# EAGLE design T05_version11_2 (EAGLE 7.1.0)
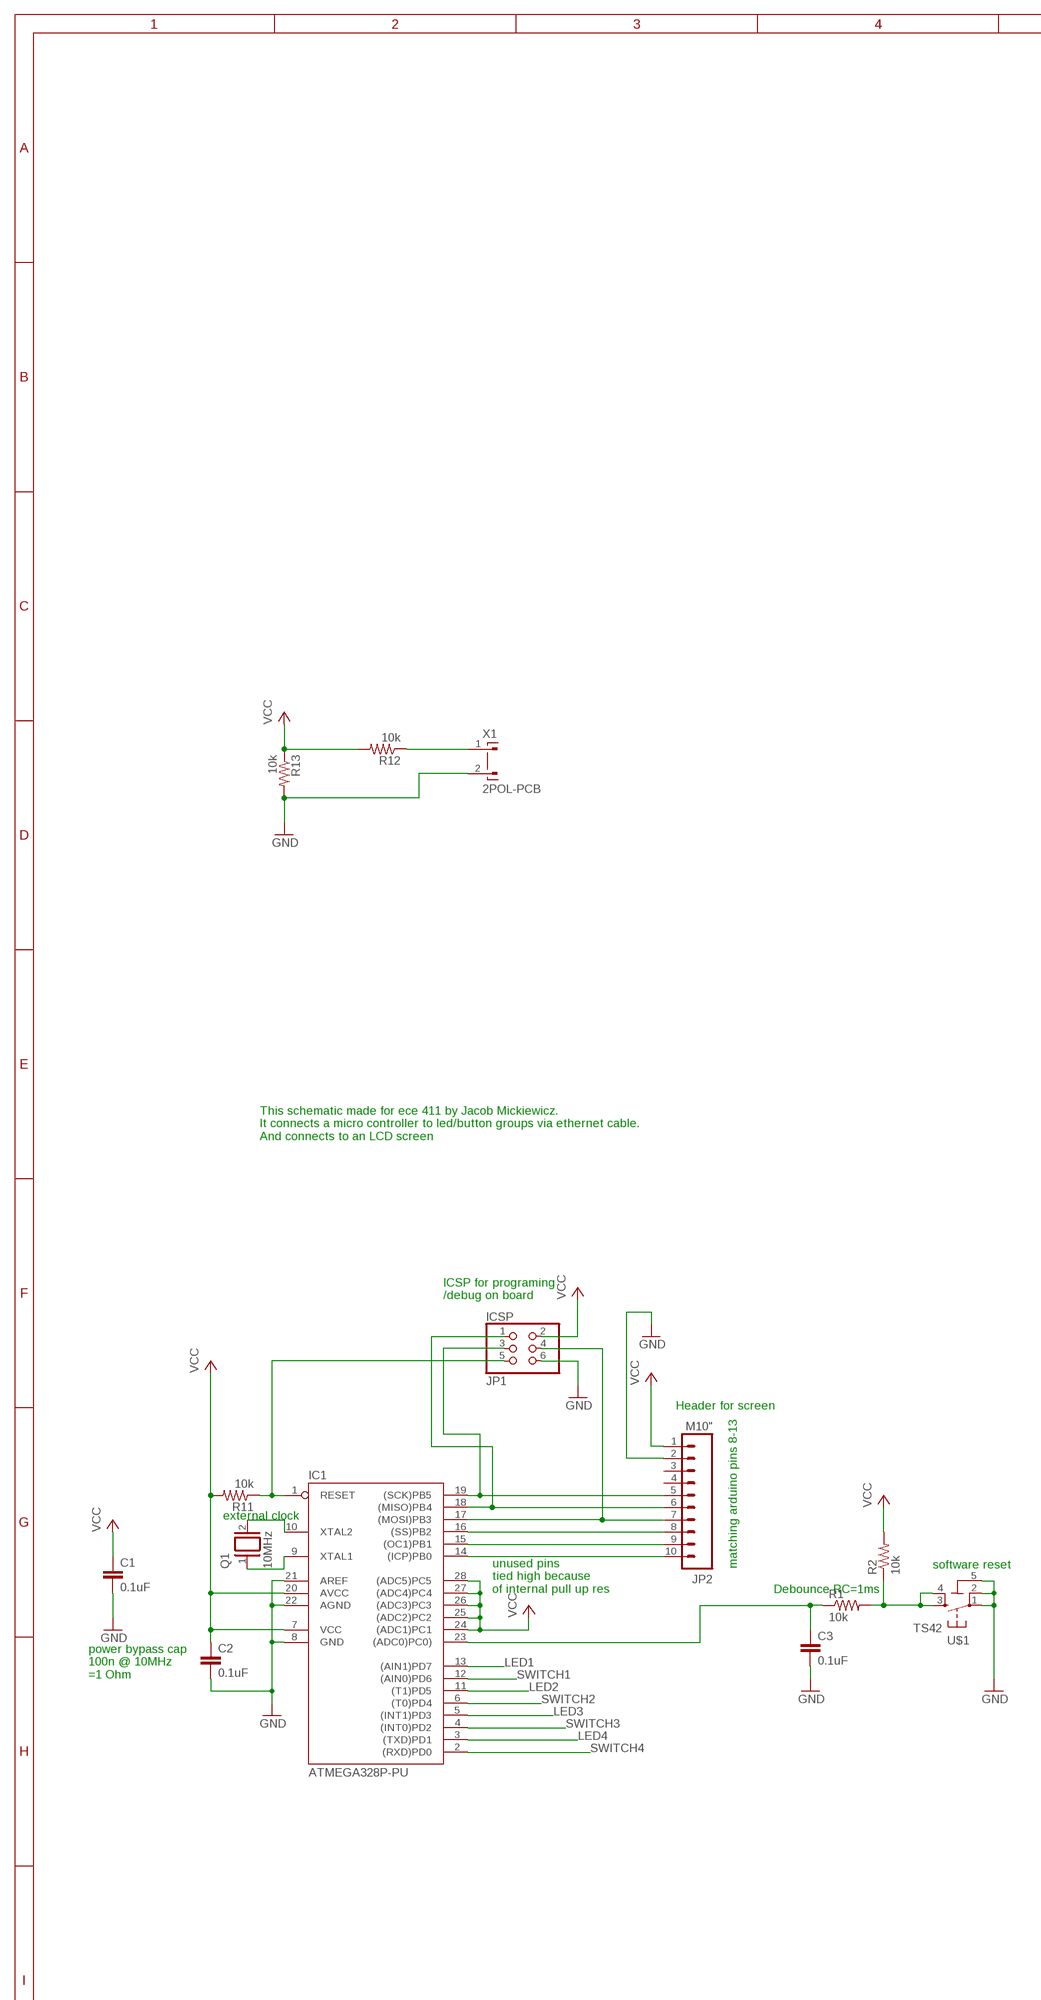
[diagram p0: schematic, sheet 1, part 1 of 2]
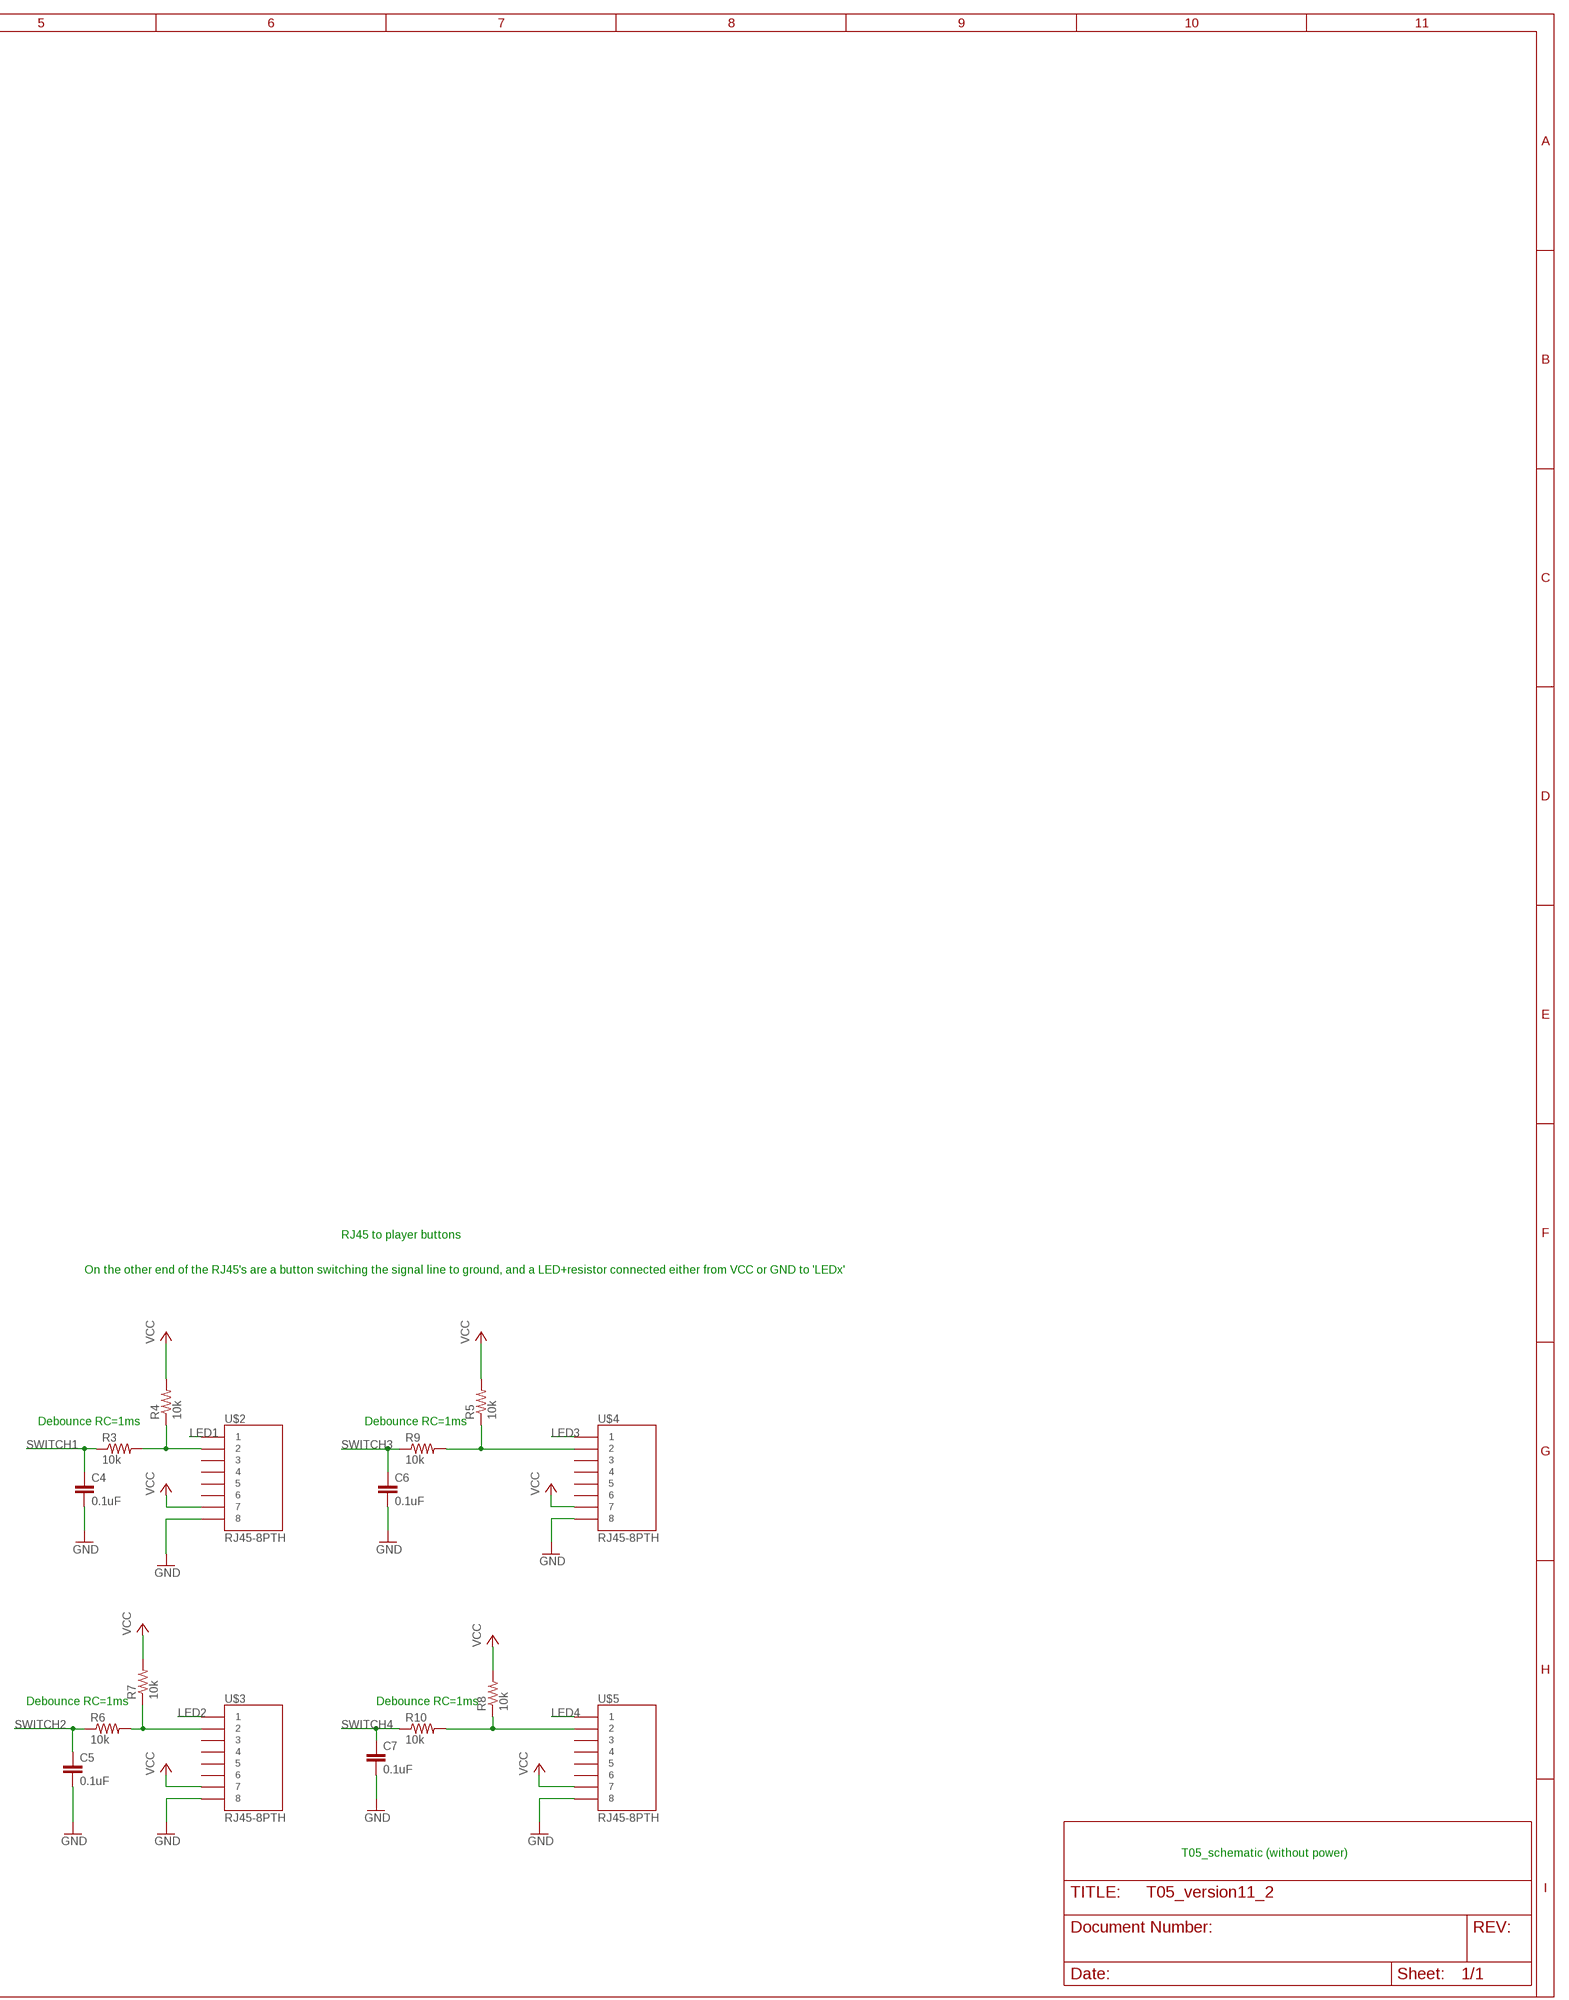
[diagram p1: schematic, sheet 1, part 2 of 2]

## Parts
C1  0.1uF  0.1UF-25V-5%(0603)  [0603-CAP]
C2  0.1uF  0.1UF-25V-5%(0603)  [0603-CAP]
C3  0.1uF  0.1UF-25V-5%(0603)  [0603-CAP]
C4  0.1uF  0.1UF-25V-5%(0603)  [0603-CAP]
C5  0.1uF  0.1UF-25V-5%(0603)  [0603-CAP]
C6  0.1uF  0.1UF-25V-5%(0603)  [0603-CAP]
C7  0.1uF  0.1UF-25V-5%(0603)  [0603-CAP]
IC1  ATMEGA328P-PU  [DIL28-3]
ICSP  JP1  PINHD-2X3  [2X03]
JP2  M10"  [1X10]
Q1  10MHz  XTAL/S  [QS]
R1  10k  RESISTOR0603-RES  [0603-RES]
R2  10k  RESISTOR0603-RES  [0603-RES]
R3  10k  RESISTOR0603-RES  [0603-RES]
R4  10k  RESISTOR0603-RES  [0603-RES]
R5  10k  RESISTOR0603-RES  [0603-RES]
R6  10k  RESISTOR0603-RES  [0603-RES]
R7  10k  RESISTOR0603-RES  [0603-RES]
R8  10k  RESISTOR0603-RES  [0603-RES]
R9  10k  RESISTOR0603-RES  [0603-RES]
R10  10k  RESISTOR0603-RES  [0603-RES]
R11  10k  RESISTOR0603-RES  [0603-RES]
R12  10k  RESISTOR0603-RES  [0603-RES]
R13  10k  RESISTOR0603-RES  [0603-RES]
U$1  TS42  [TS42]
U$2  RJ45-8PTH  [RJ45-8]
U$3  RJ45-8PTH  [RJ45-8]
U$4  RJ45-8PTH  [RJ45-8]
U$5  RJ45-8PTH  [RJ45-8]
X1  2POL-PCB  [2POL-PCB]

## Nets
GND: C1.2 C2.2 C3.2 C4.2 C5.2 C6.2 C7.2 IC1.8(GND) IC1.21(AREF) IC1.22(AGND) ICSP.6 JP2.2 R13.2 U$1.1 U$1.2 U$1.5(5-GND) U$2.8 U$3.8 U$4.8 U$5.8 X1.2
LED1: IC1.13((AIN1)PD7) U$2.1
LED2: IC1.11((T1)PD5) U$3.1
LED3: IC1.5((INT1)PD3) U$4.1
LED4: IC1.3((TXD)PD1) U$5.1
N$1: IC1.18((MISO)PB4) ICSP.1 JP2.6
N$2: IC1.19((SCK)PB5) ICSP.3 JP2.5
N$3: IC1.1(RESET) ICSP.5 R11.1
N$4: IC1.16((SS)PB2) JP2.8
N$5: IC1.15((OC1)PB1) JP2.9
N$6: IC1.17((MOSI)PB3) ICSP.4 JP2.7
N$7: IC1.14((ICP)PB0) JP2.10
N$8: R3.2 R4.1 U$2.2
N$9: R8.1 R10.2 U$5.2
N$10: R1.2 R2.1 U$1.3 U$1.4
N$11: C3.1 IC1.23((ADC0)PC0)) R1.1
N$12: R6.2 R7.1 U$3.2
N$13: R5.1 R9.2 U$4.2
N$14: IC1.10(XTAL2) Q1.2
N$15: IC1.9(XTAL1) Q1.1
N$16: R12.1 X1.1
SWITCH1: C4.1 IC1.12((AIN0)PD6) R3.1
SWITCH2: C5.1 IC1.6((T0)PD4) R6.1
SWITCH3: C6.1 IC1.4((INT0)PD2) R9.1
SWITCH4: C7.1 IC1.2((RXD)PD0) R10.1
VCC: C1.1 C2.1 IC1.7(VCC) IC1.20(AVCC) IC1.24((ADC1)PC1) IC1.25((ADC2)PC2) IC1.26((ADC3)PC3) IC1.27((ADC4)PC4) IC1.28((ADC5)PC5) ICSP.2 JP2.1 R2.2 R4.2 R5.2 R7.2 R8.2 R11.2 R12.2 R13.1 U$2.7 U$3.7 U$4.7 U$5.7
Unconnected: JP2.3 JP2.4 U$2.3 U$2.4 U$2.5 U$2.6 U$3.3 U$3.4 U$3.5 U$3.6 U$4.3 U$4.4 U$4.5 U$4.6 U$5.3 U$5.4 U$5.5 U$5.6

## Notes on the sheet
- This schematic made for ece 411 by Jacob Mickiewicz.
  It connects a micro controller to led/button groups via ethernet cable.
  And connects to an LCD screen
- ICSP for programing
  /debug on board
- RJ45 to player buttons
- On the other end of the RJ45's are a button switching the signal line to ground, and a LED+resistor connected either from VCC or GND to 'LEDx'
- Header for screen
- Debounce RC=1ms | Debounce RC=1ms
- external clock
- matching arduino pins 8-13 | software reset
- unused pins
  tied high because 
  of internal pull up res
- Debounce RC=1ms
- power bypass cap
  100n @ 10MHz
  =1 Ohm
- Debounce RC=1ms | Debounce RC=1ms
- T05_schematic (without power)

## Library data of the parts
C1-C7 = SparkFun-Capacitors:0.1UF-25V-5%(0603): CAP-08604; PROD_ID: CAP-08604
IC1 = SmartPrj:ATMEGA328P-: MICROCONTROLLER 4 Kbytes FLASH 128 bytes SRAM 256 bytes EEPROM UART 6-channel 10 bit ADC
ICSP = SparkFun-Connectors:PINHD-2X3: PIN HEADER
JP2 = SparkFun-Connectors:M10: Header 10 Standard 10-pin 0.1" header. Use with straight break away headers (SKU : PRT-00116), right angle break away headers (PRT-00553), swiss pins (PRT-00743), machine pins (PRT-00117), and female headers (PRT-00115).
Q1 = special:XTAL/S: CRYSTAL
R1-R13 = SparkFun-Passives:RESISTOR: Resistor Basic schematic elements and footprints for 0603, 1206, and PTH resistors.
U$1 = SmartPrj:TS42: TS42 Dongnan Electronics Tact switch VDC 12V - 50mA
U$2-U$5 = SparkFun-Connectors:RJ45-8: RJ45 Jack Simple RJ45, 8-pin connection - connector for common Cat5, Cat5e, and Cat6 Ethernet cables. Footprint not yet proven in production. Connector sku is PRT-00643; Breakout PCB sku is BOB-00716.
X1 = con-friwo:2POL-PCB: PCB SUPPLY CONNECTOR FRIWO (TEXAS); OC_FARNELL: unknown; OC_NEWARK: unknown

## Board
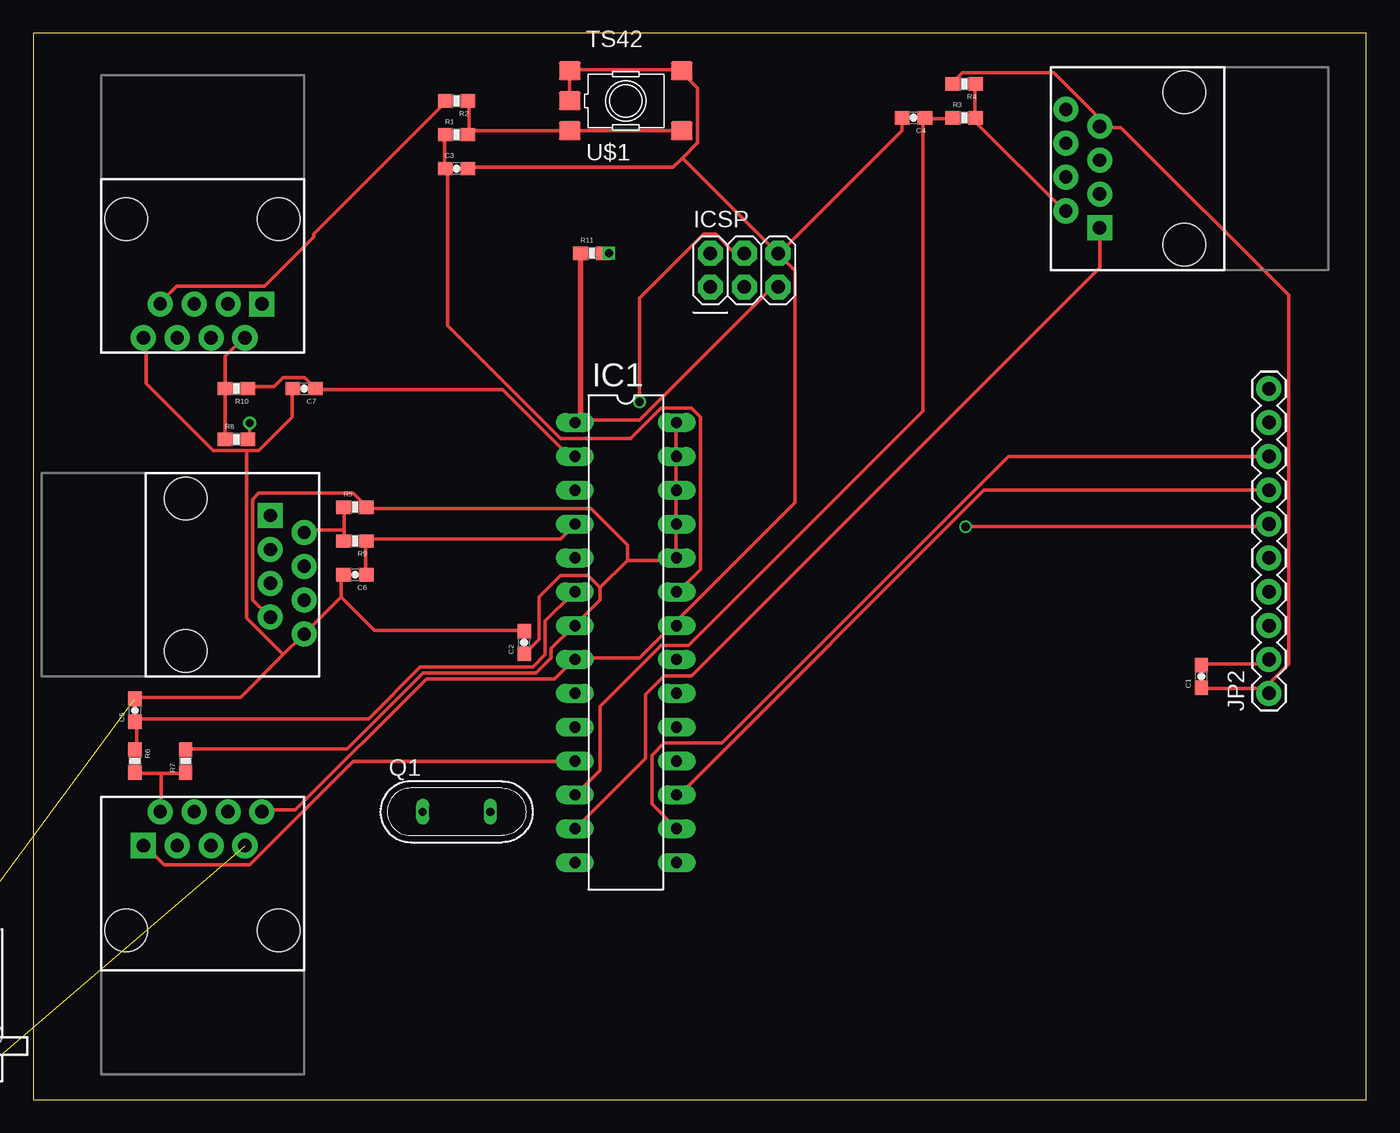
[diagram p2: board, top side]
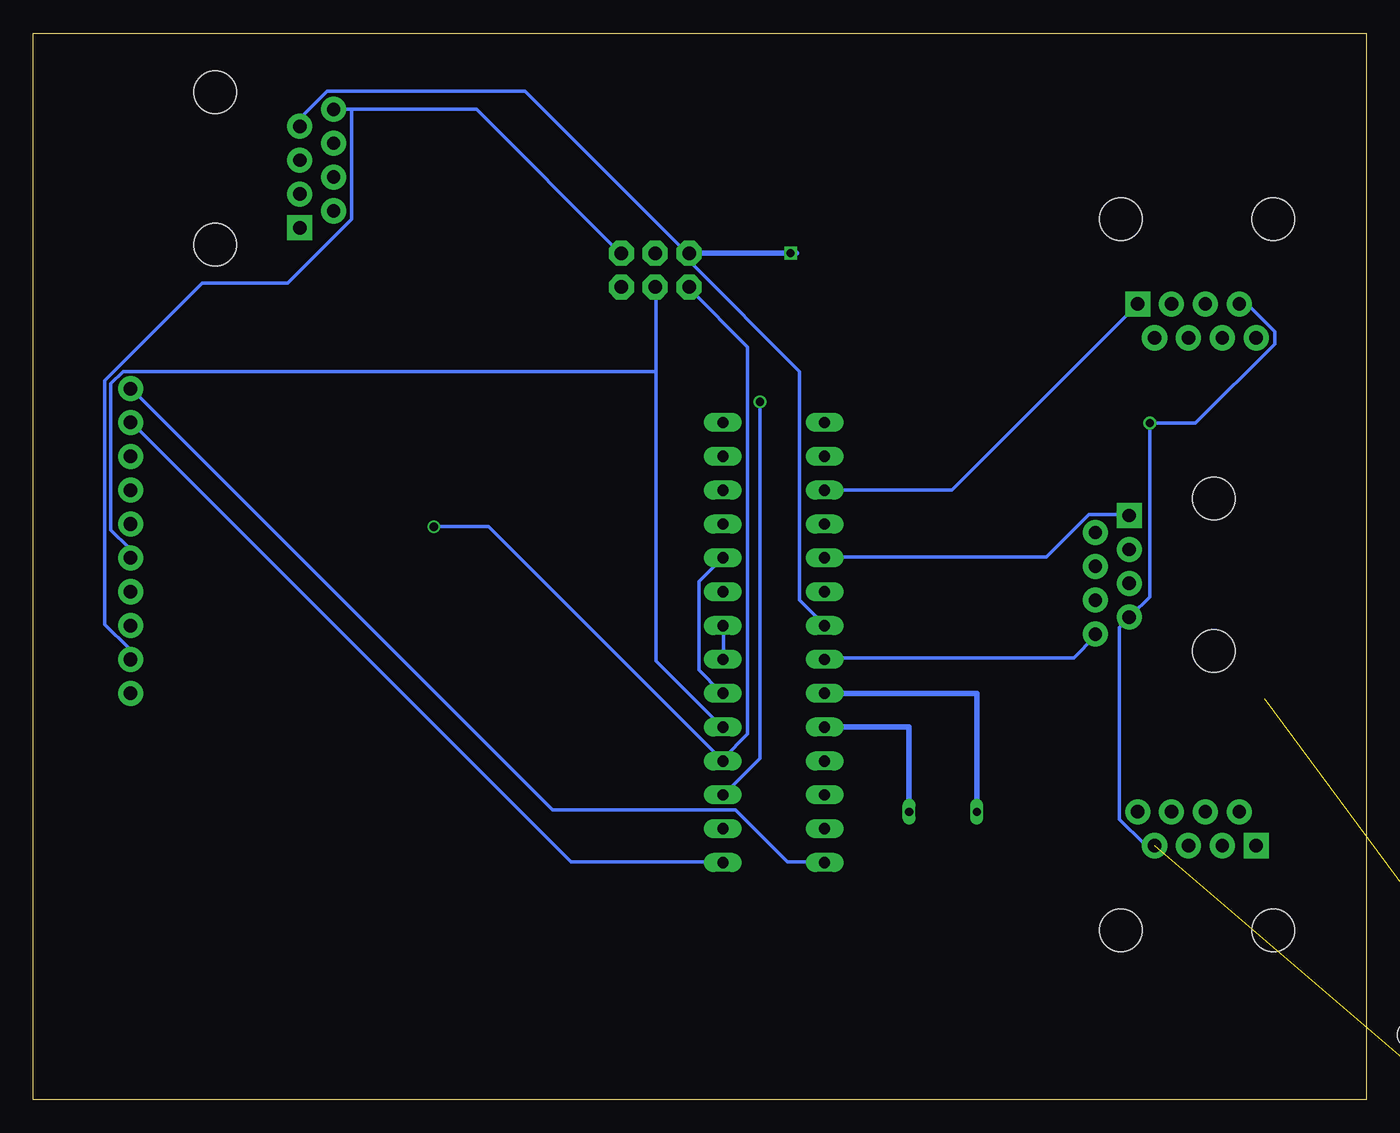
[diagram p3: board, bottom side, seen from below]

Size 100 x 80 mm. Coordinates in mm from the lower left corner, seen from the top.
Outline: 0,0 100,0 100,80 0,80 0,0
Copper layers (1*16): Top 0.0356mm / dielectric 1.5011mm / Bottom 0.0356mm
Design rules "OSH-Park-2-layer": minimum track width 6mil, minimum drill 13mil, track to track 6mil, track to pad 6mil, pad to pad 6mil, via to via 6mil, smd to smd 6mil, copper to edge 15mil, drill to drill 6mil, minimum pad ring 7mil, minimum via ring 7mil, stop-mask expansion 3mil, vias tented up to drill 0mil, thermal gap 10mil

### Footprints (pad centres in the part's own frame; a part is rotated, then mirrored left to right if it is on the bottom)
0603-CAP = smd 1.1 x 1: 1 -0.85,0; 2 0.85,0
DIL28-3 = drill 0.85 pad 1.422 long: 1 -16.51,-3.81; 2 -13.97,-3.81; 3 -11.43,-3.81; 4 -8.89,-3.81; 5 -6.35,-3.81; 6 -3.81,-3.81; 7 -1.27,-3.81; 8 1.27,-3.81; 9 3.81,-3.81; 10 6.35,-3.81; 11 8.89,-3.81; 12 11.43,-3.81; 13 13.97,-3.81; 14 16.51,-3.81; 15 16.51,3.81; 16 13.97,3.81; 17 11.43,3.81; 18 8.89,3.81; 19 6.35,3.81; 20 3.81,3.81; 21 1.27,3.81; 22 -1.27,3.81; 23 -3.81,3.81; 24 -6.35,3.81; 25 -8.89,3.81; 26 -11.43,3.81; 27 -13.97,3.81; 28 -16.51,3.81
2X03 = drill 1.016 pad 1.88 octagon: 1 -2.54,-1.27; 2 -2.54,1.27; 3 0,-1.27; 4 0,1.27; 5 2.54,-1.27; 6 2.54,1.27
1X10 = drill 1.016 pad 1.88: 1 0,0; 2 2.54,0; 3 5.08,0; 4 7.62,0; 5 10.16,0; 6 12.7,0; 7 15.24,0; 8 17.78,0; 9 20.32,0; 10 22.86,0
QS = drill 0.61 long: 1 -2.54,0; 2 2.54,0
0603-RES = smd 1.1 x 1: 1 -0.85,0; 2 0.85,0
TS42 = smd 1.6 x 1.4: 1 -4.2,2.25; 2 4.2,2.25; 3 -4.2,-2.25; 4 4.2,-2.25; 5 -4.2,0
RJ45-8 = drill 1 pad 1.88 square: 1 -4.445,6.35 | drill 1 pad 1.88: 2 -3.175,8.89; 3 -1.905,6.35; 4 -0.635,8.89; 5 0.635,6.35; 6 1.905,8.89; 7 3.175,6.35; 8 4.445,8.89 | hole 3.2: -5.715,0; 5.715,0
2POL-PCB = drill 1.2 long: 1 -1.25,11.6; 2 1.25,11.6 | hole 2: -3,3.6; 3,3.6; 0,8.6

### Placement (x,y rotation side)
C1  87.63,31.75 90 top
C2  36.83,34.29 90 top
C3  31.75,69.85 0 top
C4  66.04,73.66 180 top
C5  7.62,29.21 90 top
C6  24.13,39.37 180 top
C7  20.32,53.34 180 top
IC1  44.45,34.29 270 top
ICSP  53.34,62.23 0 top
JP2  92.71,30.48 90 top
Q1  31.75,21.59 0 top
R1  31.75,72.39 0 top
R2  31.75,74.93 180 top
R3  69.85,73.66 0 top
R4  69.85,76.2 180 top
R5  24.13,44.45 0 top
R6  7.62,25.4 270 top
R7  11.43,25.4 90 top
R8  15.24,49.53 0 top
R9  24.13,41.91 180 top
R10  15.24,53.34 180 top
R11  41.91,63.5 0 top
R12  -10.16,-2.54 0 top  (outside the outline)
R13  -10.16,-6.35 0 top  (outside the outline)
U$1  44.45,74.93 0 top
U$2  86.36,69.85 90 top
U$3  12.7,12.7 0 top
U$4  11.43,39.37 270 top
U$5  12.7,66.04 180 top
X1  -6.35,1.27 0 top  (outside the outline)

### Tracks (layer width: path | path; a pad name or v marks a point on that pad's centre or on a via)
GND  (2 unrouted)
  Top 0.254: U$3.8 17.14,21.72 19.66,21.72 29.49,31.55 39.09,31.55 40.46,32.92 IC1.8 40.69,33.15 45.49,33.15 47.78,35.43 48.23,35.43 IC1.22 48.46,35.66 48.46,36.12 57.15,44.81 57.15,62.18 56.01,63.32 ICSP.6 | 16,48.69 13.49,48.69 8.46,53.72 8.46,57.15 U$5.8 | 16,48.69 16.92,48.69 19.43,51.21 19.43,53.26 C7.2 | 18.75,33.38 20.12,34.75 U$4.8 20.34,34.98 23.09,37.72 | 18.75,33.38 15.54,30.18 7.77,30.18 C5.2 | 23.09,37.72 23.09,39.32 C6.2 | 23.09,37.72 25.6,35.2 36.8,35.2 C2.2 | 16,48.69 16,36.12 18.75,33.38 | U$1.5 40.23,74.98 40.23,77.04 U$1.1 40.46,77.27 48.46,77.27 U$1.2 48.69,77.04 49.84,75.89 49.84,71.78 48.69,70.64 | 48.69,70.64 48.01,69.95 32.69,69.95 C3.2 | C1.2 87.78,32.69 92.35,32.69 92.58,32.92 JP2.2 | C4.2 65.15,73.61 65.15,72.69 56.01,63.55 ICSP.6 | 48.69,70.64 55.78,63.55 ICSP.6
  Bottom 0.254: IC1.21 48.23,33.15 48.23,35.43 IC1.22 | IC1.8 40.46,33.15 21.95,33.15 20.34,34.75 U$4.8 | 76.12,74.3 66.75,74.3 56.01,63.55 ICSP.6 | 76.12,74.3 U$2.8 | 76.12,74.3 76.12,66.06 80.92,61.27 87.33,61.27 94.64,53.95 94.64,35.66 92.81,33.83 92.81,33.15 JP2.2
LED1
  Top 0.254: U$2.1 80.01,62.41 49.38,31.77 47.32,31.77 45.95,30.4 45.95,25.6 40.69,20.34 IC1.13
LED2
  Top 0.254: IC1.11 40.46,25.38 24,25.38 16.23,17.6 9.83,17.6 8.46,18.97 U$3.1
LED3
  Bottom 0.254: IC1.5 40.46,40.69 24,40.69 20.8,43.89 17.83,43.89 U$4.1
LED4
  Bottom 0.254: IC1.3 31.09,45.72 17.14,59.66 U$5.1
N$1  (via drill 0.61)
  Top 0.254: v69.95,42.98 92.58,42.98 JP2.6
  Bottom 0.254: ICSP.1 50.75,60.81 46.41,56.46 46.41,27.43 48.23,25.6 IC1.18 65.84,42.98 v69.95,42.98
N$2
  Bottom 0.254: 53.26,54.63 53.26,60.81 ICSP.3 | 53.26,54.63 53.26,32.92 48.46,28.12 IC1.19 | 53.26,54.63 93.27,54.63 94.18,53.72 94.18,42.75 92.81,41.38 92.81,40.69 JP2.5
N$3
  Top 0.254: IC1.1 40.69,50.98 45.49,50.98 55.32,60.81 55.78,60.81 ICSP.5
  Top 0.406: R11.1 41.06,51.22 arc-90 IC1.1
N$4
  Top 0.254: IC1.16 46.41,22.17 46.41,25.83 47.32,26.75 51.66,26.75 73.15,48.23 92.58,48.23 JP2.8
N$5
  Bottom 0.254: IC1.15 48.46,17.83 59.66,17.83 92.58,50.75 JP2.9
N$6  (via drill 0.61)
  Top 0.254: JP2.7 71.32,45.72 48.46,22.86 IC1.17 | v45.49,52.35 45.49,60.12 50.29,64.92 51.21,64.92 52.58,63.55 53.26,63.55 ICSP.4
  Bottom 0.254: v45.49,52.35 45.49,25.6 48.23,22.86 IC1.17
N$7
  Bottom 0.254: IC1.14 40.69,17.83 43.43,17.83 47.32,21.72 61.04,21.72 92.58,53.26 JP2.10
N$8
  Top 0.254: R4.1 70.64,76.12 70.64,73.84 R3.2 70.87,73.61 70.87,73.15 77.27,66.75 U$2.2
N$9
  Top 0.254: R8.1 14.4,49.61 14.4,53.26 R10.2 14.4,53.49 14.4,55.78 15.77,57.15 U$5.2
N$10
  Top 0.254: 32.69,72.69 32.69,74.75 R2.1 | 32.69,72.69 32.69,72.47 R1.2 32.69,72.69 | 32.69,72.69 40.23,72.69 U$1.3 40.46,72.69 48.46,72.69 U$1.4
N$11
  Top 0.254: R1.1 30.86,72.24 30.86,69.95 C3.1 31.09,69.72 31.09,58.06 39.55,49.61 44.81,49.61 47.09,51.89 49.38,51.89 50.06,51.21 50.06,39.78 48.46,38.18 IC1.23
N$12
  Top 0.254: 9.6,24.46 11.43,24.46 R7.1 | 9.6,24.46 7.77,24.46 R6.2 | 9.6,24.46 9.6,21.72 U$3.2
N$13
  Top 0.254: 23.32,42.75 23.32,44.35 R5.1 | 23.32,42.75 23.32,42.06 R9.2 | 23.32,42.75 20.34,42.75 U$4.2
N$14
  Bottom 0.406: Q1.2 34.29,27.94 IC1.10
N$15
  Bottom 0.406: IC1.9 29.21,30.48 Q1.1
N$16  (1 unrouted)
SWITCH1
  Top 0.254: R3.1 68.81,73.61 66.98,73.61 C4.1 66.75,73.61 66.75,51.66 49.15,34.06 47.09,34.06 42.52,29.49 42.52,24.69 40.69,22.86 IC1.12
SWITCH2
  Top 0.254: R6.1 7.77,26.29 7.77,28.35 C5.1 7.77,28.57 25.15,28.57 29.03,32.46 37.49,32.46 38.41,33.38 38.41,35.89 40.46,37.95 IC1.6
SWITCH3
  Top 0.254: C6.1 24.92,39.55 24.92,41.83 R9.1 25.15,42.06 39.55,42.06 40.46,42.98 IC1.4
SWITCH4
  Top 0.254: R10.1 16.23,53.49 18.06,53.49 18.75,54.18 20.34,54.18 21.03,53.49 C7.1 21.26,53.26 35.2,53.26 40.01,48.46 40.46,48.46 IC1.2
VCC  (via drill 0.6, 0.61)  (3 unrouted)
  Top 0.254: R2.2 30.86,74.75 21.03,64.92 21.03,64.69 17.37,61.04 10.74,61.04 9.6,59.89 U$5.7 | v16.23,50.75 16.23,49.61 R8.2 | U$4.7 17.6,36.35 16.46,37.49 16.46,45.03 16.92,45.49 24,45.49 24.92,44.58 R5.2 25.15,44.35 41.83,44.35 44.58,41.6 44.58,40.46 | 92.35,30.86 87.78,30.86 C1.1 | 92.35,30.86 92.58,30.63 JP2.1 92.35,30.86 | R4.2 69.04,76.35 69.72,77.04 76.58,77.04 80.01,73.61 U$2.7 80.01,72.92 81.61,72.92 94.18,60.35 94.18,32.69 92.35,30.86 | 48.23,45.72 48.23,48.23 IC1.27 48.23,48.46 48.23,50.75 IC1.28 | 48.23,45.72 48.23,43.2 IC1.25 48.23,42.98 48.23,40.69 IC1.24 48.23,40.46 44.58,40.46 | 48.23,45.72 IC1.26 | R7.2 11.43,26.29 23.55,26.29 29.26,32 37.72,32 38.86,33.15 38.86,33.83 40.46,35.43 IC1.7 40.69,35.66 42.52,37.49 42.52,38.41 | 42.52,38.41 41.6,39.32 39.55,39.32 37.95,37.72 37.95,34.52 37.03,33.6 C2.1 | 42.52,38.41 44.58,40.46
  Bottom 0.254: U$3.7 16,19.2 16.69,19.2 18.52,21.03 18.52,35.43 17.83,36.12 U$4.7 17.6,36.35 16.23,37.72 v16.23,50.75 12.8,50.75 6.86,56.69 6.86,57.61 8.91,59.66 9.37,59.66 U$5.7 | IC1.20 48.46,30.63 50.06,32.23 50.06,38.86 48.46,40.46 IC1.24 | IC1.7 40.69,35.66 42.52,37.49 42.52,54.63 50.75,62.87 50.75,63.32 ICSP.2 50.98,63.55 63.09,75.67 77.95,75.67 80.01,73.61 U$2.7
  Bottom 0.406: R11.2 v43.18,63.5 ICSP.2